# EAGLE schematic legacy mk1 with acc_16meg_crystal and TPs (EAGLE 9.5.2)
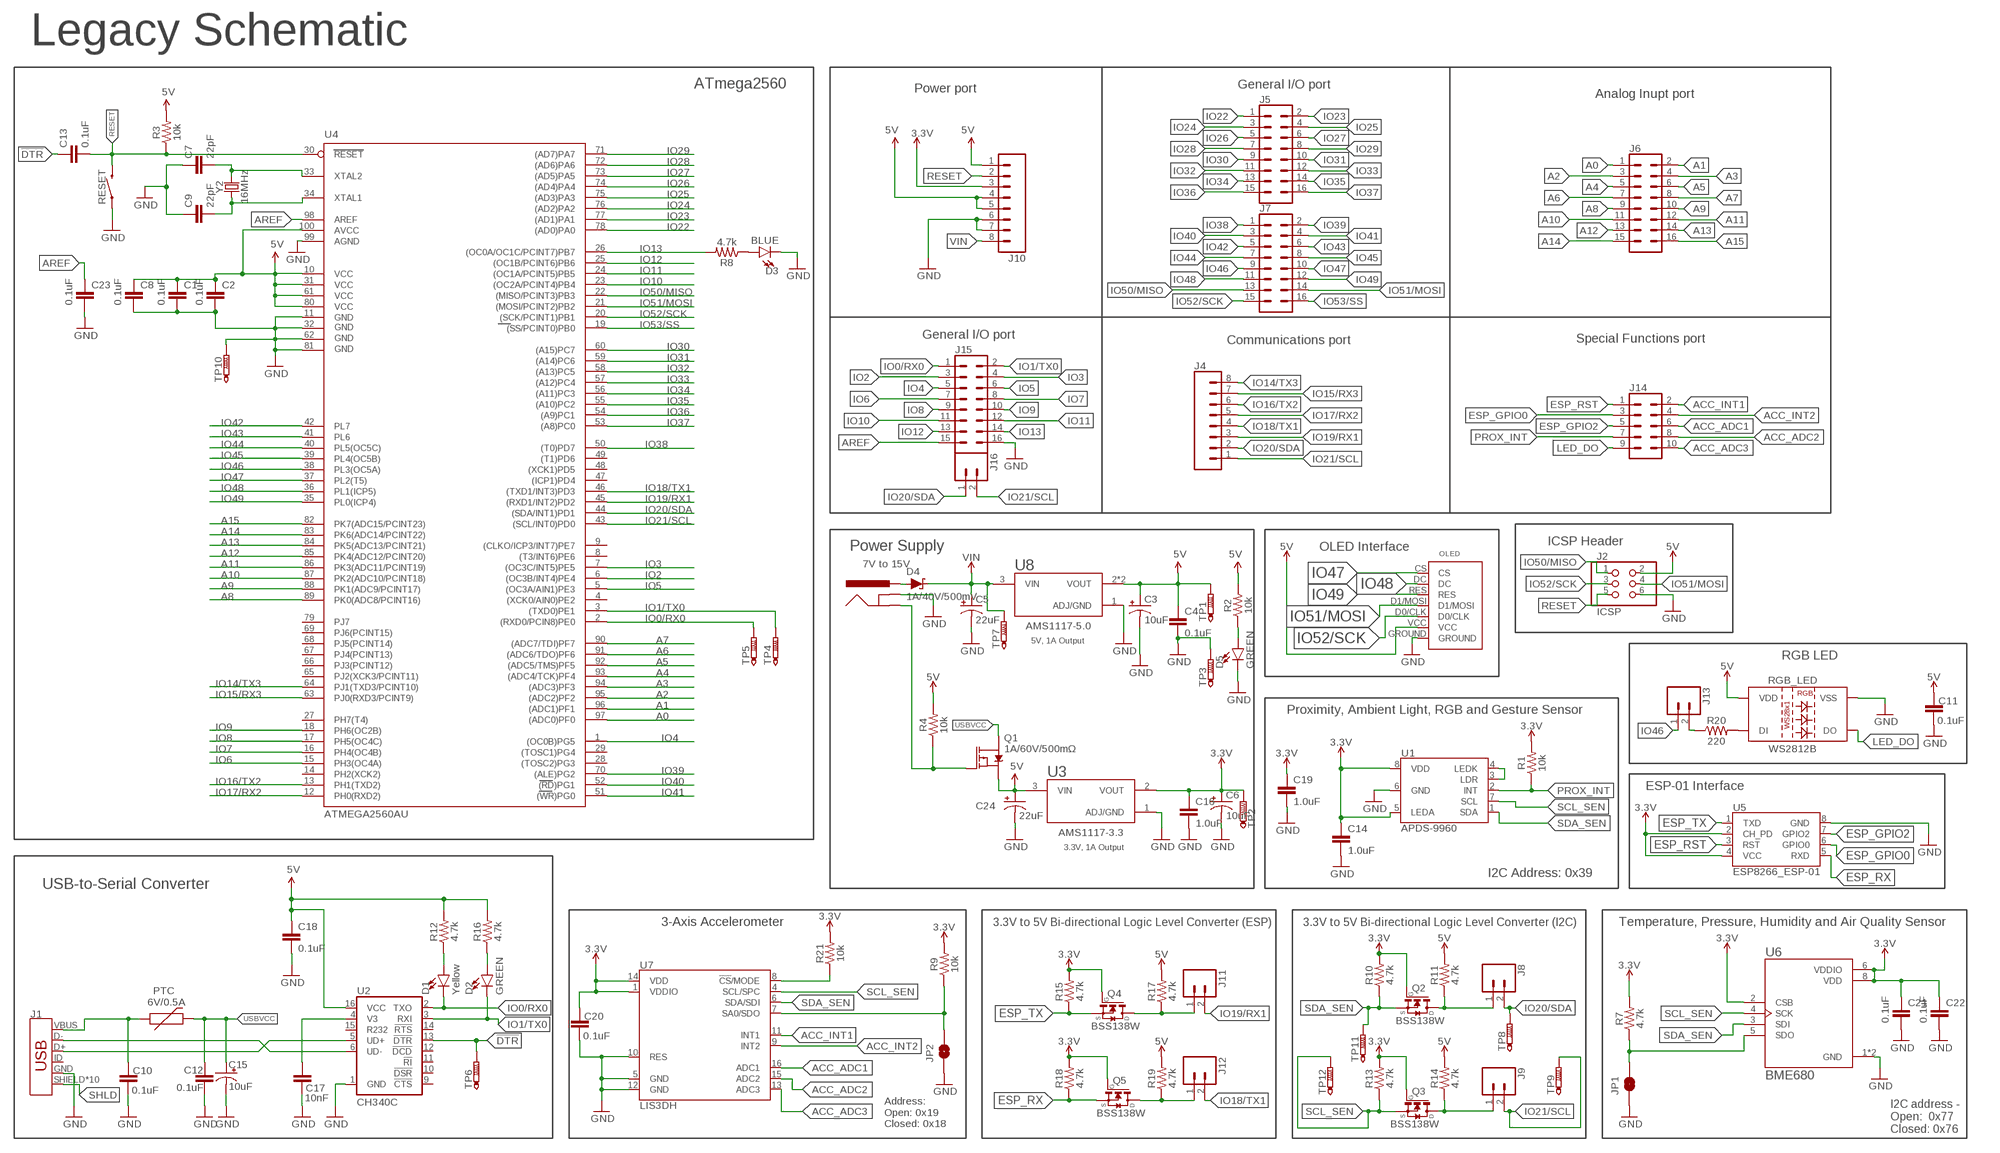
[diagram p0: schematic, sheet 1, part 1 of 2]
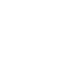
[diagram p1: schematic, sheet 1, part 2 of 2]

## Parts
C1  0.1uF  0.1UF-0603-25V-(+80/-20%)  [0603]
C2  0.1uF  0.1UF-0603-25V-(+80/-20%)  [0603]
C3  10uF  10UF-POLAR-EIA3216-16V-10%(TANT)  [EIA3216]
C4  0.1uF  0.1UF-0603-25V-(+80/-20%)  [0603]
C5  22uF  CPOL-USCT3528  [CT3528]
C6  10uF  10UF-POLAR-EIA3216-16V-10%(TANT)  [EIA3216]
C7  22pF  22PF-0603-50V-5%  [0603]
C8  0.1uF  0.1UF-0603-25V-(+80/-20%)  [0603]
C9  22pF  22PF-0603-50V-5%  [0603]
C10  0.1uF  0.1UF-0603-25V-(+80/-20%)  [0603]
C11  0.1uF  0.1UF-0603-25V-(+80/-20%)  [0603]
C12  0.1uF  0.1UF-0603-25V-(+80/-20%)  [0603]
C13  0.1uF  0.1UF-0603-25V-(+80/-20%)  [0603]
C14  1.0uF  1.0UF-16V-10%(0603)  [0603-CAP]
C15  10uF  10UF-POLAR-EIA3216-16V-10%(TANT)  [EIA3216]
C16  1.0uF  1.0UF-16V-10%(0603)  [0603-CAP]
C17  10nF  10NF/10000PF-50V-10%(0603)  [0603-CAP]
C18  0.1uF  0.1UF-0603-25V-(+80/-20%)  [0603]
C19  1.0uF  1.0UF-16V-10%(0603)  [0603-CAP]
C20  0.1uF  0.1UF-0603-25V-(+80/-20%)  [0603]
C21  0.1uF  0.1UF-0603-25V-(+80/-20%)  [0603]
C22  0.1uF  0.1UF-0603-25V-(+80/-20%)  [0603]
C23  0.1uF  0.1UF-0603-25V-(+80/-20%)  [0603]
C24  22uF  CPOL-USCT3528  [CT3528]
D1  Yellow  LED-YELLOW0603  [LED-0603]
D2  GREEN  LED-GREEN0603  [LED-0603]
D3  BLUE  LED-BLUE0603  [LED-0603]
D4  1A/40V/500mV  DIODE-SCHOTTKY-SS14  [SMA-DIODE]
D5  GREEN  LED-GREEN0603  [LED-0603]
J1  AMP FCI 10103594-0001LF  USB_MICRO-B_HALF_PTH_MILL  [USB-MICROB-PTH-MILL]
J2  ICSP  PINHD-2X3  [2X03]
J3  POWER_JACKSLT  [POWER_JACK_SLOT]
J4  CONN_08"  [1X08]
J5  CONN_08X2_HEADER  [2X8]
J6  CONN_08X2_HEADER  [2X8]
J7  CONN_08X2_HEADER  [2X8]
J8  CONN_02  [1X02]
J9  CONN_02  [1X02]
J10  CONN_08"  [1X08]
J11  CONN_02  [1X02]
J12  CONN_02  [1X02]
J13  CONN_02  [1X02]
J14  CONN_05X2PTH  [2X5]
J15  CONN_08X2_HEADER  [2X8]
J16  CONN_02  [1X02]
JP1  JUMPER-SMT_2_NO_SILK  [SMT-JUMPER_2_NO_SILK]
JP2  JUMPER-SMT_2_NO_SILK  [SMT-JUMPER_2_NO_SILK]
OLED  OLED_SHIELD  [OLED_SHIELD]
PTC  6V/0.5A  PPTC_6V500MA-2  [1206]
Q1  1A/60V/500mΩ  MOSFET-PCH-ZXMP6A13F  [SOT23-3]
Q2  BSS138W  [SOT323-R]
Q3  BSS138W  [SOT323-R]
Q4  BSS138W  [SOT323-R]
Q5  BSS138W  [SOT323-R]
R1  10k  10KOHM-0603-1/10W-1%  [0603]
R2  10k  10KOHM-0603-1/10W-1%  [0603]
R3  10k  10KOHM-0603-1/10W-1%  [0603]
R4  10k  10KOHM-0603-1/10W-1%  [0603]
R7  4.7k  4.7KOHM-0603-1/10W-1%  [0603]
R8  4.7k  4.7KOHM-0603-1/10W-1%  [0603]
R9  10k  10KOHM-0603-1/10W-1%  [0603]
R10  4.7k  4.7KOHM-0603-1/10W-1%  [0603]
R11  4.7k  4.7KOHM-0603-1/10W-1%  [0603]
R12  4.7k  4.7KOHM-0603-1/10W-1%  [0603]
R13  4.7k  4.7KOHM-0603-1/10W-1%  [0603]
R14  4.7k  4.7KOHM-0603-1/10W-1%  [0603]
R15  4.7k  4.7KOHM-0603-1/10W-1%  [0603]
R16  4.7k  4.7KOHM-0603-1/10W-1%  [0603]
R17  4.7k  4.7KOHM-0603-1/10W-1%  [0603]
R18  4.7k  4.7KOHM-0603-1/10W-1%  [0603]
R19  4.7k  4.7KOHM-0603-1/10W-1%  [0603]
R20  220  220OHM-0603-1/10W-1%  [0603]
R21  10k  10KOHM-0603-1/10W-1%  [0603]
RESET  MOMENTARY-SWITCH-SPST-PTH-6.0MM  [TACTILE_SWITCH_PTH_6.0MM]
RGB_LED  WS2812B  [WS2812B]
TP1  PTR1B1,27  [B1,27]
TP2  PTR1B1,27  [B1,27]
TP3  PTR1B1,27  [B1,27]
TP4  PTR1B1,27  [B1,27]
TP5  PTR1B1,27  [B1,27]
TP6  PTR1B1,27  [B1,27]
TP7  PTR1B1,27  [B1,27]
TP8  PTR1B1,27  [B1,27]
TP9  PTR1B1,27  [B1,27]
TP10  PTR1B1,27  [B1,27]
TP11  PTR1B1,27  [B1,27]
TP12  PTR1B1,27  [B1,27]
U1  APDS-9960  [APDS-9960]
U2  CH340C  [SO016]
U3  AMS1117-3.3  [SOT229P700X180-4N]
U4  ATMEGA2560AU  [TQFP100]
U5  ESP8266_ESP-01  [ESP8266_ESP-01]
U6  BME680  [PSON80P300X300X100-8N]
U7  LIS3DH  [LGA-16-3X3]
U8  AMS1117-5.0  [SOT229P700X180-4N]
Y2  16MHz  CRYSTAL-16MHZPTH-HC49US  [HC49US]

## Nets
3.3V: C6.+ C14.1 C16.1 C19.1 C20.1 C21.1 C22.1 J10.3 Q2.1(G) Q3.1(G) Q4.1(G) Q5.1(G) R1.2 R7.2 R9.2 R10.2 R13.2 R15.2 R18.2 R21.2 TP2.TP U1.5(LEDA) U1.8(VDD) U3.2(VOUT) U5.2(CH_PD) U5.4(VCC) U6.2(CSB) U6.6(VDDIO) U6.8(VDD) U7.1(VDDIO) U7.14(VDD)
5V: C1.1 C2.1 C3.+ C4.1 C8.1 C11.1 C18.1 C24.+ J2.2 J10.1 J10.4 J10.5 OLED.VCC Q1.2(S) R2.2 R3.2 R4.2 R11.2 R12.2 R14.2 R16.2 R17.2 R19.2 RGB_LED.1(VDD) TP1.TP U2.16(VCC) U3.3(VIN) U4.10(VCC) U4.31(VCC1) U4.61(VCC2) U4.80(VCC3) U4.100(AVCC) U8.2(VOUT) U8.4(VOUT)
!DTR: C13.1 TP6.TP U2.13(!DTR)
A0: J6.1 U4.97((ADC0)PF0)
A1: J6.2 U4.96((ADC1)PF1)
A2: J6.3 U4.95((ADC2)PF2)
A3: J6.4 U4.94((ADC3)PF3)
A4: J6.5 U4.93((ADC4/TCK)PF4)
A5: J6.6 U4.92((ADC5/TMS)PF5)
A6: J6.7 U4.91((ADC6/TDO)PF6)
A7: J6.8 U4.90((ADC7/TDI)PF7)
A8: J6.9 U4.89(PK0(ADC8/PCINT16))
A9: J6.10 U4.88(PK1(ADC9/PCINT17))
A10: J6.11 U4.87(PK2(ADC10/PCINT18))
A11: J6.12 U4.86(PK3(ADC11/PCINT19))
A12: J6.13 U4.85(PK4(ADC12/PCINT20))
A13: J6.14 U4.84(PK5(ADC13/PCINT21))
A14: J6.15 U4.83(PK6(ADC14/PCINT22))
A15: J6.16 U4.82(PK7(ADC15/PCINT23))
ACC_ADC1: J14.6 U7.16(ADC1)
ACC_ADC2: J14.8 U7.15(ADC2)
ACC_ADC3: J14.10 U7.13(ADC3)
ACC_INT1: J14.2 U7.11(INT1)
ACC_INT2: J14.4 U7.9(INT2)
AREF: C23.1 J15.15 U4.98(AREF)
ESP_GPIO0: J14.3 U5.6(GPIO0)
ESP_GPIO2: J14.5 U5.7(GPIO2)
ESP_RST: J14.1 U5.3(RST)
ESP_RX: Q5.2(S) R18.1 U5.5(RXD)
ESP_TX: Q4.2(S) R15.1 U5.1(TXD)
GND: C1.2 C2.2 C3.- C4.2 C5.- C6.- C7.1 C8.2 C9.1 C10.2 C11.2 C12.2 C14.2 C15.- C16.2 C17.2 C18.2 C19.2 C20.2 C21.2 C22.2 C23.2 C24.- D3.C D5.C J1.GND J2.6 J3.GND@1(GNDBREAK) J10.6 J10.7 J15.16 JP1.1 JP2.1 OLED.GROUND RESET.1 RGB_LED.3(VSS) TP3.TP TP10.TP U1.6(GND) U2.1(GND) U3.1(ADJ/GND) U4.11(GND) U4.32(GND1) U4.62(GND2) U4.81(GND3) U4.99(AGND) U5.8(GND) U6.1(GND) U6.7(GND) U7.5(GND) U7.10(RES) U7.12(GND) U8.1(ADJ/GND)
INSERT: J3.GND@2(GND) Q1.1(G) R4.1
IO0/RX0: D1.C J15.1 TP5.TP U2.2(TXO) U4.2((RXD0/PCIN8)PE0)
IO1/TX0: D2.C J15.2 TP4.TP U2.3(RXI) U4.3((TXD0)PE1)
IO2: J15.3 U4.6((OC3B/INT4)PE4)
IO3: J15.4 U4.7((OC3C/INT5)PE5)
IO4: J15.5 U4.1((OC0B)PG5)
IO5: J15.6 U4.5((OC3A/AIN1)PE3)
IO6: J15.7 U4.15(PH3(OC4A))
IO7: J15.8 U4.16(PH4(OC4B))
IO8: J15.9 U4.17(PH5(OC4C))
IO9: J15.10 U4.18(PH6(OC2B))
IO10: J15.11 U4.23((OC2A/PCINT4)PB4)
IO11: J15.12 U4.24((OC1A/PCINT5)PB5)
IO12: J15.13 U4.25((OC1B/PCINT6)PB6)
IO13: J15.14 R8.2 U4.26((OC0A/OC1C/PCINT7)PB7)
IO14/TX3: J4.8 U4.64(PJ1(TXD3/PCINT10))
IO15/RX3: J4.7 U4.63(PJ0(RXD3/PCINT9))
IO16/TX2: J4.6 U4.13(PH1(TXD2))
IO17/RX2: J4.5 U4.12(PH0(RXD2))
IO18/TX1: J4.4 J12.2 U4.46((TXD1/INT3)PD3)
IO19/RX1: J4.3 J11.2 U4.45((RXD1/INT2)PD2)
IO20/SDA: J4.2 J8.2 J16.1 TP8.TP U4.44((SDA/INT1)PD1)
IO21/SCL: J4.1 J9.2 J16.2 TP9.TP U4.43((SCL/INT0)PD0)
IO22: J5.1 U4.78((AD0)PA0)
IO23: J5.2 U4.77((AD1)PA1)
IO24: J5.3 U4.76((AD2)PA2)
IO25: J5.4 U4.75((AD3)PA3)
IO26: J5.5 U4.74((AD4)PA4)
IO27: J5.6 U4.73((AD5)PA5)
IO28: J5.7 U4.72((AD6)PA6)
IO29: J5.8 U4.71((AD7)PA7)
IO30: J5.9 U4.60((A15)PC7)
IO31: J5.10 U4.59((A14)PC6)
IO32: J5.11 U4.58((A13)PC5)
IO33: J5.12 U4.57((A12)PC4)
IO34: J5.13 U4.56((A11)PC3)
IO35: J5.14 U4.55((A10)PC2)
IO36: J5.15 U4.54((A9)PC1)
IO37: J5.16 U4.53((A8)PC0)
IO38: J7.1 U4.50((T0)PD7)
IO39: J7.2 U4.70((ALE)PG2)
IO40: J7.3 U4.52((RD)PG1)
IO41: J7.4 U4.51((WR)PG0)
IO42: J7.5 U4.42(PL7)
IO43: J7.6 U4.41(PL6)
IO44: J7.7 U4.40(PL5(OC5C))
IO45: J7.8 U4.39(PL4(OC5B))
IO46: J7.9 J13.1 U4.38(PL3(OC5A))
IO47: J7.10 OLED.CS U4.37(PL2(T5))
IO48: J7.11 OLED.DC U4.36(PL1(ICP5))
IO49: J7.12 OLED.RES U4.35(PL0(ICP4))
IO50/MISO: J2.1 J7.13 U4.22((MISO/PCINT3)PB3)
IO51/MOSI: J2.4 J7.14 OLED.D1/MOSI U4.21((MOSI/PCINT2)PB2)
IO52/SCK: J2.3 J7.15 OLED.D0/CLK U4.20((SCK/PCINT1)PB1)
IO53/SS: J7.16 U4.19((SS/PCINT0)PB0)
LED_DO: J14.9 RGB_LED.2(DO)
N$1: C7.2 U4.33(XTAL2) Y2.2
N$2: D5.A R2.1
N$3: C9.2 U4.34(XTAL1) Y2.1
N$4: JP1.2 R7.1 U6.5(SDO)
N$5: D2.A R16.1
N$6: C17.1 U2.4(V3)
N$7: U1.3(LDR) U1.4(LEDK)
N$8: D3.A R8.1
N$9: D1.A R12.1
N$10: JP2.2 R9.1 U7.7(SA0/SDO)
N$11: J13.2 R20.1
N$12: J8.1 Q2.3(D) R11.1
N$13: J1.D- U2.6(UD-)
N$14: J1.D+ U2.5(UD+)
N$17: J11.1 Q4.3(D) R17.1
N$18: J9.1 Q3.3(D) R14.1
N$19: R21.1 U7.8(!CS!/MODE)
N$20: R20.2 RGB_LED.4(DI)
N$21: J12.1 Q5.3(D) R19.1
PROX_INT: J14.7 R1.1 U1.2(INT)
PWRIN: D4.A J3.PWR
RESET: C13.2 J2.5 J10.2 R3.1 RESET.3 U4.30(RESET)
SCL_SEN: Q3.2(S) R13.1 TP12.TP U1.7(SCL) U6.4(SCK) U7.4(SCL/SPC)
SDA_SEN: Q2.2(S) R10.1 TP11.TP U1.1(SDA) U6.3(SDI) U7.6(SDA/SDI)
SHLD: J1.SHIELD J1.SHIELD2(SHIELD) J1.SHIELD3(SHIELD) J1.SHIELD4(SHIELD) J1.SHIELD5(SHIELD) J1.SHIELD6(SHIELD) J1.SHIELD7(SHIELD) J1.SHIELD8(SHIELD) J1.SHIELD9(SHIELD) J1.SHIELD10(SHIELD)
USBVCC: C12.1 C15.+ PTC.2 Q1.3(D)
VIN: C5.+ D4.C J10.8 TP7.TP U8.3(VIN)
VUSB: C10.1 J1.VBUS PTC.1
Unconnected: J1.ID U2.9(!CTS) U2.10(!DSR) U2.11(!RI) U2.12(!DCD) U2.14(!RTS) U2.15(R232) U4.4((XCK0/AIN0)PE2) U4.8((T3/INT6)PE6) U4.9((CLKO/ICP3/INT7)PE7) U4.14(PH2(XCK2)) U4.27(PH7(T4)) U4.28((TOSC2)PG3) U4.29((TOSC1)PG4) U4.47((ICP1)PD4) U4.48((XCK1)PD5) U4.49((T1)PD6) U4.65(PJ2(XCK3/PCINT11)) U4.66(PJ3(PCINT12)) U4.67(PJ4(PCINT13)) U4.68(PJ5(PCINT14)) U4.69(PJ6(PCINT15)) U4.79(PJ7)

## Notes on the sheet
- Legacy Schematic
- Power port
- ATmega2560 | General I/O port | Analog Inupt port
- Special Functions port
- General I/O port
- Communications port
- ICSP Header
- Power Supply | OLED Interface
- 7V to 15V
- 5V, 1A Output
- RGB LED
- Proximity, Ambient Light, RGB and Gesture Sensor
- ESP-01 Interface
- 3.3V, 1A Output
- I2C Address: 0x39
- USB-to-Serial Converter
- 3-Axis Accelerometer | 3.3V to 5V Bi-directional Logic Level Converter (ESP) | 3.3V to 5V Bi-directional Logic Level Converter (I2C) | Temperature, Pressure, Humidity and Air Quality Sensor
- Address:
  Open: 0x19
  Closed: 0x18
- I2C address -
  Open:  0x77
  Closed: 0x76

## Library data of the parts
C1 C2 C4 C8 C10-C13 C18 C20-C23 = SparkFun-Capacitors:0.1UF: 0.1µF ceramic capacitors A capacitor is a passive two-terminal electrical component used to store electrical energy temporarily in an electric field.; PROD_ID: CAP-00810
C3 C6 C15 = SparkFun-Capacitors:10UF-POLAR: 10.0µF polarized capacitors A capacitor is a passive two-terminal electrical component used to store electrical energy temporarily in an electric field.; PROD_ID: CAP-00811
C5 C24 = rcl:CPOL-US: POLARIZED CAPACITOR, American symbol; SPICEPREFIX: C
C7 C9 = SparkFun-Capacitors:22PF: 22pF ceramic capacitors A capacitor is a passive two-terminal electrical component used to store electrical energy temporarily in an electric field.; PROD_ID: CAP-07876
C14 C16 C19 = SparkFun-Capacitors:1.0UF-16V-10%(0603): CAP-00868; PROD_ID: CAP-00868
C17 = SparkFun-Capacitors:10NF/10000PF-50V-10%(0603): CAP-00867; PROD_ID: CAP-00867
D1 = SparkFun-LED:LED-YELLOW: Yellow SMD LED Used in manufacturing several products at SparkFun. Packages: 0603 - SMD 0603 package[Product Link] <http://www.kingbrightusa.com/product.asp?catalog_name=LED&product_id=APT1608SYCK> 0603 -SMART - SMART SMD 0603 package (more efficient/more expensive) [Product Link] <http://www.osram-os.com/osram_os/en/products/product-catalog/led-light-emitting-diodes/smartled-0603/ly-l29k/index.jsp> LilyPad - SMD1206 package[Product Datasheet] <https://www.sparkfun.com/datasheets/DevTools/LilyPad/Q150YUS4.pdf> SparkFun Products: Blynk Board <https://www.sparkfun.com/products/13794> IOIO-OTG <https://www.sparkfun.com/products/13613> XBee Explorer Serial <https://www.sparkfun.com/products/13225>; PROD_ID: DIO-09003
D2 D5 = SparkFun-LED:LED-GREEN: Green SMD LED Used in manufacturing of various products at SparkFun Packages: 0603 - SMD 0603 package [Product Link] <http://www.futureelectronics.com/en/technologies/semiconductors/optoelectronics/leds/Pages/9894312-LTST-C190GKT.aspx?CrossPart=HSMG-C190&IM=0> LilyPad 1206 - SMD1206 LilyPad package [Product Link] <http://www.futureelectronics.com/en/Technologies/Product.aspx?ProductID=IN150NGHARVATEKCORPORATION2049943&IM=0> 1206 - SMD1206 package [Product Link] <http://www.futureelectronics.com/en/technologies/semiconductors/optoelectronics/leds/Pages/8315665-LTST-C150KGKT.aspx?IM=0> 1206 Bottom Mount -SMD 1206 Bottom Mount [Product Link] <http://www.digikey.com/product-detail/en/lite-on-inc/LTST-C230KGKT/160-1456-1-ND/386854> SparkFun Products: Pro Mini 328 -5V <https://www.sparkfun.com/products/821> RedBoard <https://www.sparkfun.com/products/12757> MP3 Trigger <https://www.sparkfun.com/products/13720> Makey Makey <https://www.sparkfun.com/products/11076>; PROD_ID: DIO-00821
D3 = SparkFun-LED:LED-BLUE: Blue SMD LED Used in manufacturing of various products at SparkFun Packages: 0603 - SMD 0603 package [Product Link] <http://www.digikey.com/product-detail/en/SMLE12BC7TT86/511-1589-2-ND/1641808> 1206 - SMD1206 package [Product Link] <http://www.digikey.com/product-detail/en/lite-on-inc/LTST-C150TBKT/160-1643-1-ND/573584> SparkFun Products: ESP8266 Thing-Dev Board <https://www.sparkfun.com/products/13711> RedBoard <https://www.sparkfun.com/products/12757>; PROD_ID: DIO-08575
D4 = SparkFun-DiscreteSemi:DIODE-SCHOTTKY: Schottky diode A Schottky diode is a semiconductor diode which has a low forward voltage drop and a very fast switching action.; PROD_ID: DIO-08053
J1 = SparkFun-Connectors:USB_MICRO-B: USB Type Micro-B Connector Male/female and PTH/SMT variants SparkFun Products: SparkFun microB USB Breakout <https://www.sparkfun.com/products/12035> SparkFun USB microB Plug Breakout <https://www.sparkfun.com/products/10031> SparkFun ESP8266 Thing <https://www.sparkfun.com/products/13231>; PROD_ID: CONN-13711
J2 = pinhead:PINHD-2X3: PIN HEADER
J3 = SparkFun-Connectors:POWER_JACK: Power Jack Connector This is the standard 5.5mm barrel jack for power. The PTH is the most common, proven, reliable, footprint. The Slot footprint only works if the mill layer is transmitted to the PCB fab house so be warned. Here are the connectors we sell at SparkFun: DC Barrel Power Jack/Connector <https://www.sparkfun.com/products/119> (PRT-00119) DC Barrel Power Jack/Connector (SMD) <https://www.sparkfun.com/products/12748> (PRT-12748) DC Barrel Jack Adapter - Breadboard Compatible <https://www.sparkfun.com/products/10811> (PRT-10811) It is used on this SparkFun product (and many, many others): SparkFun RedBoard - Programmed with Arduino <https://www.sparkfun.com/products/12757> (DEV-12757) Also, if you need a mating power supply or connector, please check these out: Wall Adapter Power Supply - 9VDC 650mA <https://www.sparkfun.com/products/298> (TOL-00298) DC Barrel Jack Adapter - Male <https://www.sparkfun.com/products/10287> (PRT-10287); PROD_ID: PRT-00119
J4 J10 = SparkFun-Connectors:CONN_08: Multi connection point. Often used as Generic Header-pin footprint for 0.1 inch spaced/style header connections On any of the 0.1 inch spaced packages, you can populate with these: Break Away Headers - Straight <https://www.sparkfun.com/products/116> (PRT-00116) Break Away Male Headers - Right Angle <https://www.sparkfun.com/products/553> (PRT-00553) Female Headers <https://www.sparkfun.com/products/115> (PRT-00115) Break Away Headers - Machine Pin <https://www.sparkfun.com/products/117> (PRT-00117) Break Away Female Headers - Swiss Machine Pin <https://www.sparkfun.com/products/743> (PRT-00743) Arduino Stackable Header - 8 Pin <https://www.sparkfun.com/products/9279> (PRT-09279) For SCREWTERMINALS and SPRING TERMINALS visit here: Screw Terimnals on SparkFun.com <https://www.sparkfun.com/search/results?term=Screw+Terminals> (5mm/3.5mm/2.54mm spacing) This device is also useful as a general connection point to wire up your design to another part of your project. Our various solder wires solder well into these plated through hole pads. Hook-Up Wire - Assortment (Stranded, 22 AWG) <https://www.sparkfun.com/products/11375> (PRT-11375) Hook-Up Wire - Assortment (Solid Core, 22 AWG) <https://www.sparkfun.com/products/11367> (PRT-11367) View the entire wire category on our website here <https://www.sparkfun.com/categories/141> Special notes: Molex polarized connector foot print use with SKU : PRT-08231 with associated crimp pins and housings. 1MM SMD Version SKU: PRT-10208 NOTES ON THE VARIANTS LOCK and LOCK_LONGPADS... This footprint was designed to help hold the alignment of a through-hole component (i.e. 6-pin header) while soldering it into place. You may notice that each hole has been shifted either up or down by 0.005 of an inch from it's more standard position (which is a perfectly straight line). This slight alteration caused the pins (the squares in the middle) to touch the edges of the holes. Because they are alternating, it causes a "brace" to hold the component in place. 0.005 has proven to be the perfect amount of "off-center" position when using our standard breakaway headers. Although looks a little odd when you look at the bare footprint, once you have a header in there, the alteration is very hard to notice. Also,if you push a header all the way into place, it is covered up entirely on the bottom side.; PROD_ID: CONN-08438
J5-J7 J15 = SparkFun-Connectors:CONN_08X2: Multi connection point. Often used as Generic Header-pin footprint for 0.1 inch spaced/style header connections You can populate with any combo of single row headers, but if you'd like an exact match, check this: Header - 2x8 (Male, 0.1") <https://www.sparkfun.com/products/13156> (PRT-13156) On any of the 0.1 inch spaced packages, you can populate with these: Break Away Headers - Straight <https://www.sparkfun.com/products/116> (PRT-00116) Break Away Male Headers - Right Angle <https://www.sparkfun.com/products/553> (PRT-00553) Female Headers <https://www.sparkfun.com/products/115> (PRT-00115) Break Away Headers - Machine Pin <https://www.sparkfun.com/products/117> (PRT-00117) Break Away Female Headers - Swiss Machine Pin <https://www.sparkfun.com/products/743> (PRT-00743)
J8 J9 J11-J13 J16 = SparkFun-Connectors:CONN_02: Multi connection point. Often used as Generic Header-pin footprint for 0.1 inch spaced/style header connections On any of the 0.1 inch spaced packages, you can populate with these: Break Away Headers - Straight <https://www.sparkfun.com/products/116> (PRT-00116) Break Away Male Headers - Right Angle <https://www.sparkfun.com/products/553> (PRT-00553) Female Headers <https://www.sparkfun.com/products/115> (PRT-00115) Break Away Headers - Machine Pin <https://www.sparkfun.com/products/117> (PRT-00117) Break Away Female Headers - Swiss Machine Pin <https://www.sparkfun.com/products/743> (PRT-00743) For SCREWTERMINALS and SPRING TERMINALS visit here: Screw Terimnals on SparkFun.com <https://www.sparkfun.com/search/results?term=Screw+Terminals> (5mm/3.5mm/2.54mm spacing) This device is also useful as a general connection point to wire up your design to another part of your project. Our various solder wires solder well into these plated through hole pads. Hook-Up Wire - Assortment (Stranded, 22 AWG) <https://www.sparkfun.com/products/11375> (PRT-11375) Hook-Up Wire - Assortment (Solid Core, 22 AWG) <https://www.sparkfun.com/products/11367> (PRT-11367) View the entire wire category on our website here <https://www.sparkfun.com/categories/141> Special notes: Molex polarized connector foot print use with: PRT-08233 with associated crimp pins and housings. 2.54_SCREWTERM for use with PRT-10571. 3.5mm Screw Terminal footprints for PRT-08084 5mm Screw Terminal footprints for use with PRT-08432
J14 = SparkFun-Connectors:CONN_05X2: Multi connection point. Often used as Generic Header-pin footprint for 0.1 inch spaced/style header connections For AVR SPI programming port, see special device with nice symbol: "AVR_SPI_PROG_5x2.dev" You can populate with any combo of single row headers, but if you'd like an exact match, check these: 2x5 AVR ICSP Male Header <https://www.sparkfun.com/products/778> (PRT-00778) 2x5 Pin Shrouded Header <https://www.sparkfun.com/products/8506> (PRT-08506) On any of the 0.1 inch spaced packages, you can populate with these: Break Away Headers - Straight <https://www.sparkfun.com/products/116> (PRT-00116) Break Away Male Headers - Right Angle <https://www.sparkfun.com/products/553> (PRT-00553) Female Headers <https://www.sparkfun.com/products/115> (PRT-00115) Break Away Headers - Machine Pin <https://www.sparkfun.com/products/117> (PRT-00117) Break Away Female Headers - Swiss Machine Pin <https://www.sparkfun.com/products/743> (PRT-00743) Special note: the shrouded connector mates well with our 5x2 ribbon cables: 2x5 Pin IDC Ribbon Cable <https://www.sparkfun.com/products/8535> (PRT-08535); PROD_ID: CONN-08499; SF_ID: PRT-0778
JP1 JP2 = SparkFun-Jumpers:JUMPER-SMT_2_NO: Normally open jumper This jumper has two pads in close proximity to each other. Apply solder to close the connection. Round pads are easier to solder for beginners, but are a lot larger. SparkFun Product that uses the round pads: SparkFun EL Sequencer <https://www.sparkfun.com/products/12781>
OLED = oled_shield:OLED_SHIELD: This is an OLED display shield for 0.96" OLED display module (SSD1306). Resolution: 128*64 pixels.
PTC = SparkFun-Fuses:PPTC: Resettable Fuse PPTC Resettable Fuse. Really a sort of resistor with a polymeric positive temperature coefficient whose resistance increases dramatically with an increase in temperature. When heated by the power passing through the resistance rises causing the current to be limited, protecting the circuit. This is achieved by the transition of the polymer from a crystalline to an amorphous state where the conductive carbon separates breaking the conductive pathways found in the cool crystalline structure. When a PPTC cools back down it resumes conducting letting the circuit turn back on. SparkFun Products: SparkFun RedBoard - Programmed with Arduino <https://www.sparkfun.com/products/12757> Pro Micro - 5V/16MHz <https://www.sparkfun.com/products/12640> Arduino Pro 328 - 5V/16MHz <https://www.sparkfun.com/products/10915> MP3 Trigger <https://www.sparkfun.com/products/13720>; PROD_ID: RES-08585
Q1 = SparkFun-DiscreteSemi:MOSFET-PCH: P-channel MOSFETs Voltage controlled devices that allow control of high current outputs.; PROD_ID: TRANS-08285
Q2-Q5 = BSS138W:BSS138W: N-Channel MOSFET; DESCRIPTION: N-Channel 50 V 3.5 Ohm SMT Enhancement Mode Field Effect Transistor - SOT-323; DIGI-KEY_PART_NUMBER: BSS138WCT-ND; DIGI-KEY_PURCHASE_URL: https://www.digikey.com/product-detail/en/on-semiconductor/BSS138W/BSS138WCT-ND/3907886?utm_source=snapeda&utm_medium=aggregator&utm_campaign=symbol; MF: ON Semiconductor; MP: BSS138W; PACKAGE: SOT-323 ON Semiconductor
R1-R4 R9 R21 = SparkFun-Resistors:10KOHM: 10kΩ resistor A resistor is a passive two-terminal electrical component that implements electrical resistance as a circuit element. Resistors act to reduce current flow, and, at the same time, act to lower voltage levels within circuits. - Wikipedia; PROD_ID: RES-00824
R7 R8 R10-R19 = SparkFun-Resistors:4.7KOHM: 4.7kΩ resistor A resistor is a passive two-terminal electrical component that implements electrical resistance as a circuit element. Resistors act to reduce current flow, and, at the same time, act to lower voltage levels within circuits. - Wikipedia; PROD_ID: RES-07857
R20 = SparkFun-Resistors:220OHM: 220Ω resistor A resistor is a passive two-terminal electrical component that implements electrical resistance as a circuit element. Resistors act to reduce current flow, and, at the same time, act to lower voltage levels within circuits. - Wikipedia; PROD_ID: RES-07861
RESET = SparkFun-Switches:MOMENTARY-SWITCH-SPST: Momentary Switch (Pushbutton) - SPST Normally-open (NO) SPST momentary switches (buttons, pushbuttons). Variants PTH-12MM - 12mm square, through-hole Momentary Pushbutton Switch - 12mm Square <https://www.sparkfun.com/products/9190> (COM-09190) PTH-6.0MM, PTH-6.0MM-KIT - 6.0mm square, through-hole Mini Pushbutton Switch <https://www.sparkfun.com/products/97> (COM-00097) KIT package intended for soldering kit's - only one side of pads' copper is exposed. PTH-RIGHT-ANGLE-KIT - Right-angle, through-hole Right Angle Tactile Button <https://www.sparkfun.com/products/10791> - Used on SparkFun BigTime Watch Kit <https://www.sparkfun.com/products/11734> SMD-12MM - 12mm square, surface-mount Tactile Button - SMD (12mm) <https://www.sparkfun.com/products/12993> (COM-12993) Used on SparkFun PicoBoard <https://www.sparkfun.com/products/11888> SMD-4.5MM - 4.5mm Square Trackball Switch Used on SparkFun Blackberry Trackballer Breakout <https://www.sparkfun.com/products/13169> SMD-4.6MMX2.8MM - 4.60mm x 2.80mm, surface mount Used on SparkFun SAMD21 Mini Breakout <https://www.sparkfun.com/products/13664> SMD-5.2MM, SMD-5.2-REDUNDANT - 5.2mm square, surface-mount Mini Pushbutton Switch - SMD <https://www.sparkfun.com/products/8720> (COM-08720) Used on Arduino Pro Mini <https://www.sparkfun.com/products/11114> REDUNDANT package connects both switch circuits together SMD-6.0X3.5MM - 6.0 x 3.5mm, surface mount Momentary Reset Switch SMD <https://www.sparkfun.com/products/8229> (COM-08229) SMD-6.2MM-TALL - 6.2mm square, surface mount Tactile Button - SMD (6mm) <https://www.sparkfun.com/products/12992> Used on SparkFun Digital Sandbox <https://www.sparkfun.com/products/12651> SMD-RIGHT-ANGLE - Right-angle, surface mount Used on SparkFun Block for Intel® Edison - Arduino <https://www.sparkfun.com/products/13036>; PROD_ID: SWCH-08441; SF_SKU: COM-00097
RGB_LED = SparkFun-LED:WS2812B: WS2812B SMD addressable RGB LED 5x5mm SMD LED with built-in controller IC. Color: Red/Green/Blue mC Rating: RGB: 390, 660, 180 mcd Forward Voltage: RGB: 2.0, 3.0, 3.0 V Packages:WS2812B SparkFun Products: Blynk Board - ESP8266 <https://www.sparkfun.com/products/13794>; PROD_ID: DIO-12503
TP1-TP12 = testpad:PTR1: TEST PIN
U1 = APDS-9960:APDS-9960: Avago APDS-9960 Digital Proximity, Ambient Light, RGB, and Gesture Sensor. The APDS-9960 offers ambient light and color measuring, proximity detection, and touchless gesture sensing. It features UV and IR blocking filters, four separate diodes sensitive to different directions, and an I2C compatible interface. Datasheet <https://cdn.sparkfun.com/datasheets/Sensors/Proximity/apds9960.pdf> SparkFun Products SparkFun RGB and Gesture Sensor - APDS-9960 <https://www.sparkfun.com/products/12787> (SEN-12787); AVAILABILITY: Unavailable; DESCRIPTION: Digital Ambient Light and Proximity Sensor 8-Pin SMD T/R; MF: Broadcom Limited; MP: APDS-9960; PACKAGE: SMD-8 Broadcom; PRICE: None
U2 = SparkFun-IC-Comms:CH340C; PROD_ID: IC-14038
U3 = AMS1117-3.3:AMS1117-3.3: Sot223/Pkg 1-Amp 3.3-Volt Low Drop Out Voltage Regulatator; AVAILABILITY: Unavailable; DESCRIPTION: Sot223/Pkg 1-Amp 3.3-Volt Low Drop Out Voltage Regulatator; MF: Advanced Monolithic Systems; MP: AMS1117-3.3; PACKAGE: None; PRICE: None
U4 = SparkFun-IC-Microcontroller:ATMEGA2560: Atmel 100-pin 8-bit uC 64/128/256 Kbytes FLASH 4 Kbytes EEPROM 8 Kbytes SRAM 86 General Purpose I/O pins 12-channels16-bit PWM 4 x Serial USARTs 16-channels 10-bit A/D SparkFun Products None.; PROD_ID: IC-10040
U5 = SparkFun-RF:ESP8266_ESP-01: ESP8266 ESP-01 Module The ESP8266 WiFi Module is a self contained SOC with integrated TCP/IP protocol stack that can give any microcontroller access to your WiFi network. The ESP8266 is capable of either hosting an application or offloading all Wi-Fi networking functions from another application processor. Each ESP8266 module comes pre-programmed with an AT command set firmware, meaning, you can simply hook this up to your Arduino device and get about as much WiFi-ability as a WiFi Shield offers (and that’s just out of the box)! The ESP8266 module is an extremely cost effective board with a huge, and ever growing, community. This module has a powerful enough on-board processing and storage capability that allows it to be integrated with the sensors and other application specific devices through its GPIOs with minimal development up-front and minimal loading during runtime. Its high degree of on-chip integration allows for minimal external circuitry, including the front-end module, is designed to occupy minimal PCB area. The ESP8266 supports APSD for VoIP applications and Bluetooth co-existance interfaces, it contains a self-calibrated RF allowing it to work under all operating conditions, and requires no external RF parts. SparkFun Product Page <https://www.sparkfun.com/products/13678>; SF_ID: WRL-13678
U6 = BME680:BME680: Integrated Environmental Unit; DESCRIPTION: Integrated Environmental Unit; DIGI-KEY_PART_NUMBER: 828-1077-1-ND; DIGI-KEY_PURCHASE_URL: https://www.digikey.in/product-detail/en/bosch-sensortec/BME680/828-1077-1-ND/7401321?utm_source=snapeda&utm_medium=aggregator&utm_campaign=symbol; MF: Bosch Sensortec; MP: BME680; PACKAGE: LGA-8 Bosch Tools
U7 = SparkFun-Sensors:LIS3DH: ST Microelectronics LIS3DH 3-Axis ±2/4/8/16g SPI/I2C Accelerometer The LIS3DH is a three axis MEMS linear accelerometer in the "nano" family. It has a digital I2C/SPI serial interface which makes it ideal for using in embedded applications. The device also features ultra low-power operational modes that allow advanced power saving and smart sleep to wake-up functions, built in detections with interrupts, and auxiliary ADC inputs Datasheet-XXXX <http://www.sparkfun.com/datasheets/Sensors/Accelerometer/LIS3DH.pdf> SparkFun Products SparkFun Triple Axis Accelerometer Breakout - LIS3DH <https://www.sparkfun.com/products/10345> (SEN-XXXXX) Triple Axis Accelerometer - LIS3DH <https://www.sparkfun.com/products/9755> (SEN-XXXXX); PROD_ID: IC-13419; SF_ID: N/A
U8 = AMS1117-5.0:AMS1117-5.0: Sot223/Pkg 1-Amp 5-Volt Low Drop Out Voltage Regulatator; AVAILABILITY: Unavailable; DESCRIPTION: Sot223/Pkg 1-Amp 5-Volt Low Drop Out Voltage Regulatator; MF: Advanced Monolithic Systems; MP: AMS1117-5.0; PACKAGE: None; PRICE: None
Y2 = SparkFun-Clocks:CRYSTAL-16MHZ: 16MHz Crystal Digikey Example <http://www.digikey.com/product-search/en?keywords=535-9122-1-ND> Frequency: 16MHz Frequency Stability: ±50ppm Frequency Tolerance: ±20ppm Load Capacitance: 18pF SparkFun Products: Pro Micro -5V/16MHz <https://www.sparkfun.com/products/12640> SparkFun Serial Enabled LCD Kit <https://www.sparkfun.com/products/10097>; PROD_ID: XTAL-08181; SF_ID: COM-00536